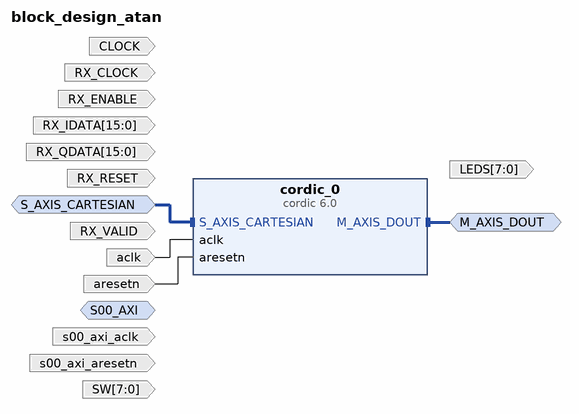
[diagram p0: block diagram of the top level]
# Vivado block design block_design_atan, xc7z020clg484-1, Vivado 2023.2.2
create_bd_design block_design_atan

create_bd_intf_port -mode Master -vlnv xilinx.com:interface:axis_rtl:1.0 M_AXIS_DOUT
set_property -dict {CONFIG.FREQ_HZ 1000000} [get_bd_intf_ports M_AXIS_DOUT]
create_bd_intf_port -mode Slave -vlnv xilinx.com:interface:axis_rtl:1.0 S_AXIS_CARTESIAN
set_property -dict [list \
  CONFIG.FREQ_HZ 1000000 \
  CONFIG.HAS_TKEEP 0 \
  CONFIG.HAS_TLAST 0 \
  CONFIG.HAS_TREADY 1 \
  CONFIG.HAS_TSTRB 0 \
  CONFIG.LAYERED_METADATA undef \
  CONFIG.TDATA_NUM_BYTES 8 \
  CONFIG.TDEST_WIDTH 0 \
  CONFIG.TID_WIDTH 0 \
  CONFIG.TUSER_WIDTH 0 \
] [get_bd_intf_ports S_AXIS_CARTESIAN]
create_bd_intf_port -mode Slave -vlnv xilinx.com:interface:aximm_rtl:1.0 S00_AXI
create_bd_port -dir I -type clk aclk
set_property -dict {CONFIG.FREQ_HZ 1000000} [get_bd_ports aclk]
create_bd_port -dir I -type rst aresetn
create_bd_port -dir I -type clk CLOCK
create_bd_port -dir I -type clk RX_CLOCK
create_bd_port -dir I RX_ENABLE
create_bd_port -dir I -from 15 -to 0 RX_IDATA
create_bd_port -dir I -from 15 -to 0 RX_QDATA
create_bd_port -dir I -type rst RX_RESET
create_bd_port -dir I RX_VALID
create_bd_port -dir I -from 7 -to 0 SW
create_bd_port -dir O -from 7 -to 0 LEDS
create_bd_port -dir I -type clk s00_axi_aclk
create_bd_port -dir I -type rst s00_axi_aresetn

create_bd_cell -type ip -vlnv xilinx.com:ip:cordic:6.0 cordic_0
set_property -dict [list \
  CONFIG.ARESETN true \
  CONFIG.Architectural_Configuration Word_Serial \
  CONFIG.Data_Format SignedFraction \
  CONFIG.Functional_Selection Arc_Tan \
  CONFIG.Input_Width 32 \
  CONFIG.Output_Width 16 \
  CONFIG.Phase_Format Scaled_Radians \
  CONFIG.Pipelining_Mode Optimal \
  CONFIG.flow_control NonBlocking \
] [get_bd_cells cordic_0]

# ---- connections ----

connect_bd_intf_net -intf_net S_AXIS_CARTESIAN_0_1 [get_bd_intf_ports S_AXIS_CARTESIAN] [get_bd_intf_pins cordic_0/S_AXIS_CARTESIAN]
connect_bd_intf_net [get_bd_intf_ports M_AXIS_DOUT] [get_bd_intf_pins cordic_0/M_AXIS_DOUT]
connect_bd_net -net aclk_0_1 [get_bd_ports aclk] [get_bd_pins cordic_0/aclk]
connect_bd_net -net aresetn_0_1 [get_bd_ports aresetn] [get_bd_pins cordic_0/aresetn]

validate_bd_design
save_bd_design
